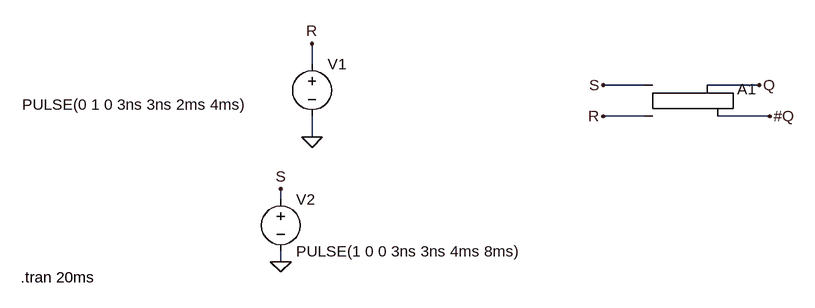
[diagram p0: schematic Latch.asc]
Latch.asc, the LTspice schematic file:
Version 4
SHEET 1 880 680
WIRE -48 48 -48 16
WIRE 464 80 400 80
WIRE 640 80 560 80
WIRE 464 128 400 128
WIRE 656 128 576 128
WIRE -48 160 -48 128
WIRE -96 256 -96 240
WIRE -96 352 -96 336
FLAG -48 160 0
FLAG -96 352 0
FLAG -48 16 R
FLAG -96 240 S
FLAG 400 80 S
FLAG 400 128 R
FLAG 640 80 Q
FLAG 656 128 #Q
SYMBOL voltage -48 32 R0
WINDOW 3 -446 78 Left 2
WINDOW 123 0 0 Left 0
WINDOW 39 0 0 Left 0
SYMATTR Value PULSE(0 1 0 3ns 3ns 2ms 4ms)
SYMATTR InstName V1
SYMBOL voltage -96 240 R0
WINDOW 123 0 0 Left 0
WINDOW 39 0 0 Left 0
SYMATTR InstName V2
SYMATTR Value PULSE(1 0 0 3ns 3ns 4ms 8ms)
SYMBOL Digital\\srflop 512 32 R0
SYMATTR InstName A1
TEXT -496 376 Left 2 !.tran 20ms

The netlist it stands for:
* Latch.asc
V1 R 0 PULSE(0 1 0 3ns 3ns 2ms 4ms)
V2 S 0 PULSE(1 0 0 3ns 3ns 4ms 8ms)
A1 S R 0 0 0 #Q Q 0 SRFLOP
.tran 20ms
.backanno
.end